# Altium schematic sheet MainBoard.SchDoc
size 381 x 241 mm
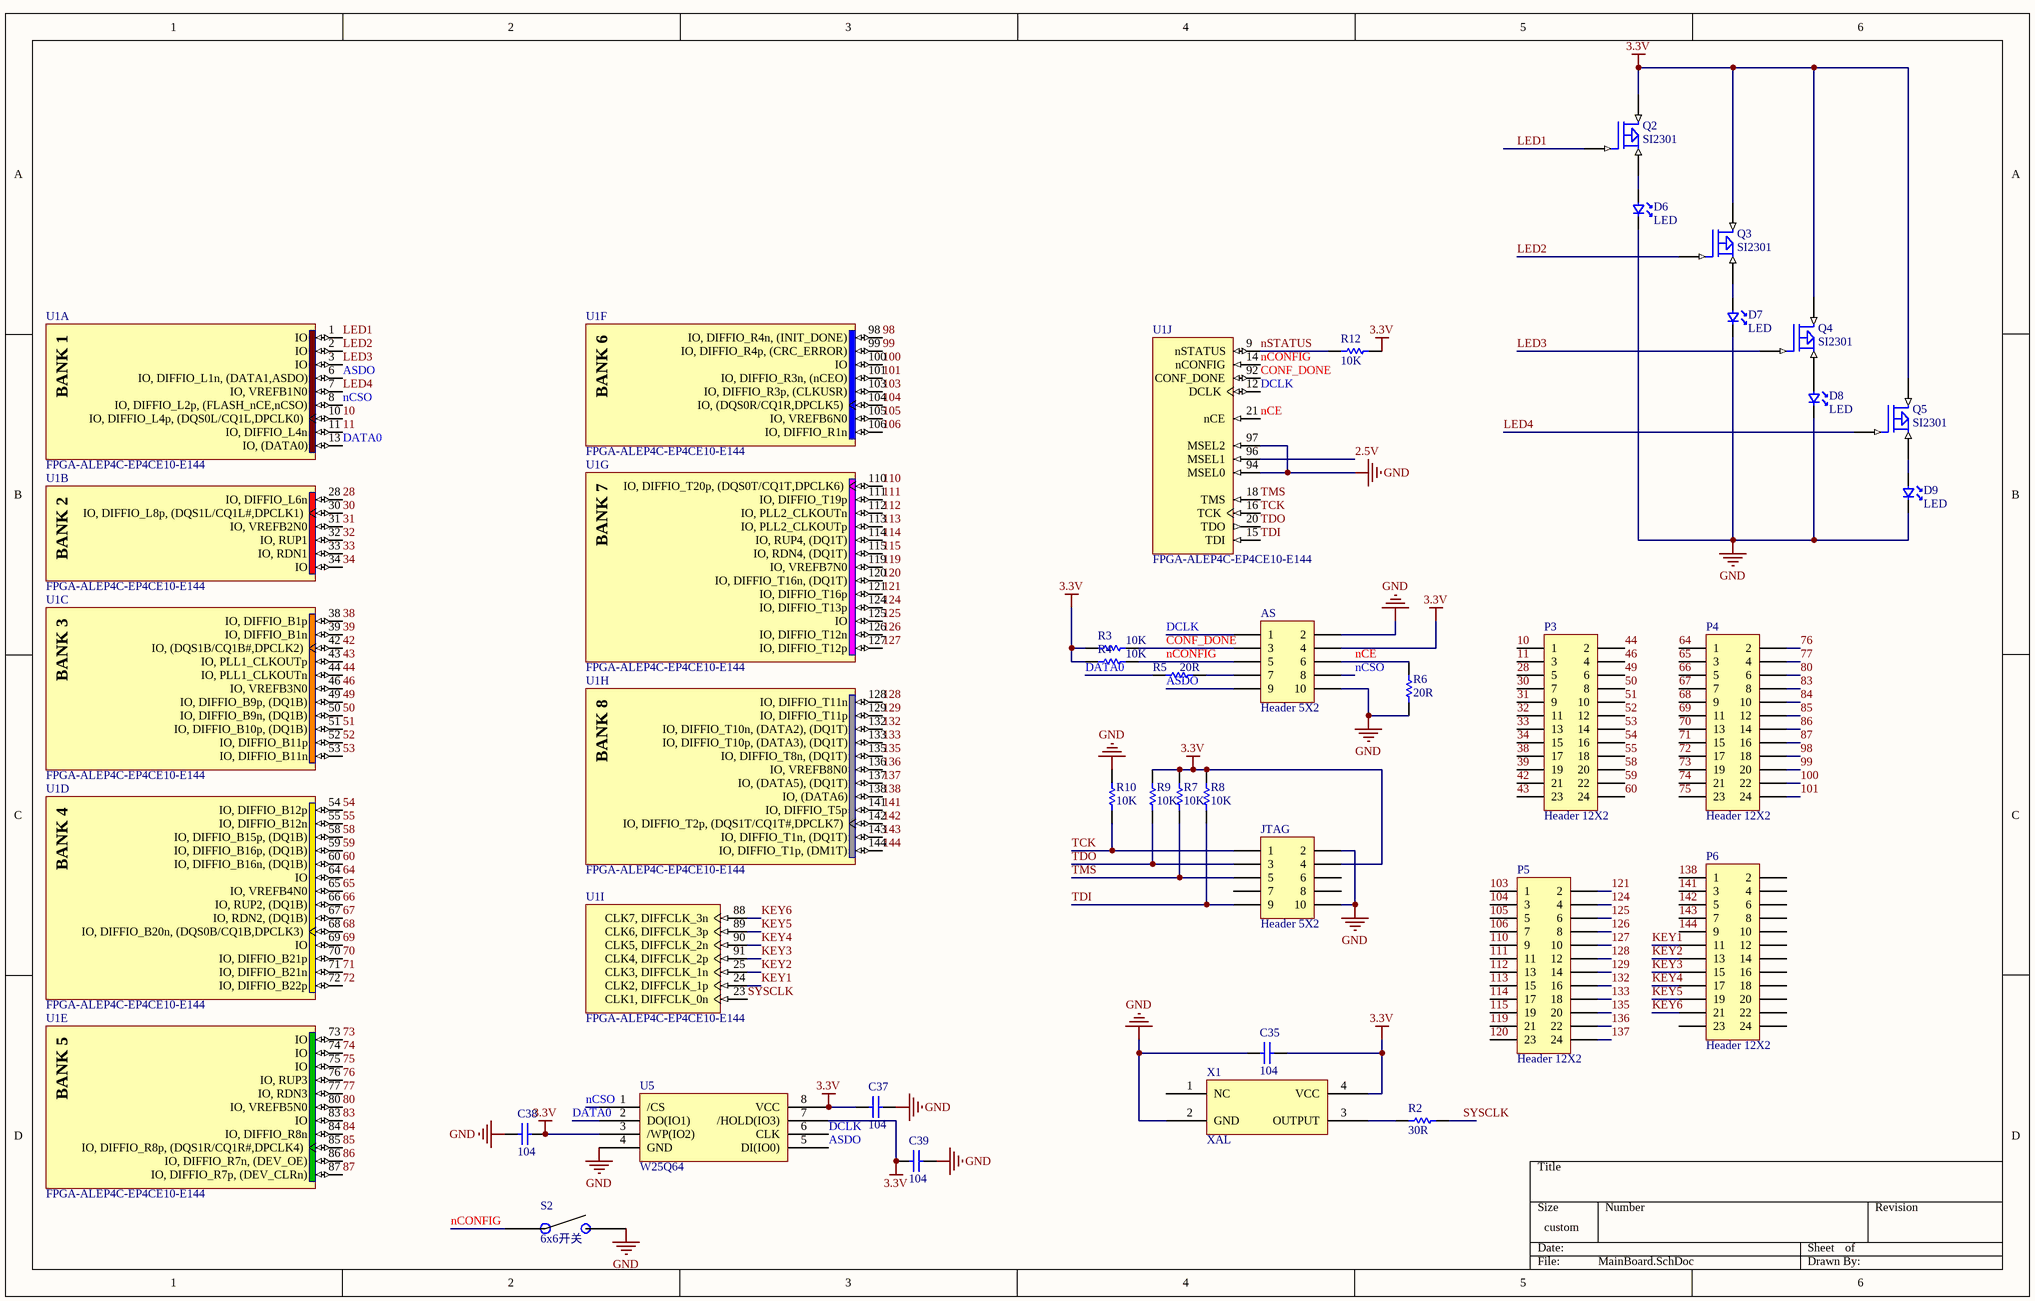
[diagram p0: MainBoard.SchDoc]

## Parts
AS  Header 5X2  [HDR2X5]
C35  104  [0805]
C37  104  [0805]
C38  104  [0805]
C39  104  [0805]
D6  LED  [0805_s]
D7  LED  [0805_s]
D8  LED  [0805_s]
D9  LED  [0805_s]
JTAG  Header 5X2  [HDR2X5]
P3  Header 12X2  [HDR2X12]
P4  Header 12X2  [HDR2X12]
P5  Header 12X2  [HDR2X12]
P6  Header 12X2  [HDR2X12]
Q2  SI2301  [SOT-23]
Q3  SI2301  [SOT-23]
Q4  SI2301  [SOT-23]
Q5  SI2301  [SOT-23]
R2  30R  [0805]
R3  10K  [0805]
R4  10K  [0805]
R5  20R  [0805]
R6  20R  [0805]
R7  10K  [0805]
R8  10K  [0805]
R9  10K  [0805]
R10  10K  [0805]
R12  10K  [0805]
S2  6x6开关  [AN66]
U1  FPGA-ALEP4C-EP4CE10-E144  [EQFP144_A-165_D2-54_L]  (parts A,B,C,D,E,F,G,H,I,J of 13)
U5  W25Q64  [LC-SOIC-8_150mil]
X1  XAL  [XAL-SMD-3225_4P]

## Nets
3.3V: AS.4 C35.2 C37.1 C38.2 C39.1 JTAG.4 Q2.2(S) Q3.2(S) Q4.2(S) Q5.2(S) R3.1 R4.1 R7.2 R8.2 R9.2 R12.2 U5.3(/WP(IO2)) U5.7(/HOLD(IO3)) U5.8(VCC) X1.4(VCC)
GND: AS.2 AS.10 C35.1 C37.2 C38.1 C39.2 D6.1 D7.1 D8.1 D9.1 JTAG.2 JTAG.10 R6.1 R10.2 S2.1 U1.94(MSEL0) U1.97(MSEL2) U5.4(GND) X1.2(GND)
2.5V: U1.96(MSEL1)
10: P3.1 U1.10(IO,_DIFFIO_L4p,_(DQS0L/CQ1L,DPCLK0))
11: P3.3 U1.11(IO,_DIFFIO_L4n)
28: P3.5 U1.28(IO,_DIFFIO_L6n)
30: P3.7 U1.30(IO,_DIFFIO_L8p,_(DQS1L/CQ1L#,DPCLK1))
31: P3.9 U1.31(IO,_VREFB2N0)
32: P3.11 U1.32(IO,_RUP1)
33: P3.13 U1.33(IO,_RDN1)
34: P3.15 U1.34(IO)
38: P3.17 U1.38(IO,_DIFFIO_B1p)
39: P3.19 U1.39(IO,_DIFFIO_B1n)
42: P3.21 U1.42(IO,_(DQS1B/CQ1B#,DPCLK2))
43: P3.23 U1.43(IO,_PLL1_CLKOUTp)
44: P3.2 U1.44(IO,_PLL1_CLKOUTn)
46: P3.4 U1.46(IO,_VREFB3N0)
49: P3.6 U1.49(IO,_DIFFIO_B9p,_(DQ1B))
50: P3.8 U1.50(IO,_DIFFIO_B9n,_(DQ1B))
51: P3.10 U1.51(IO,_DIFFIO_B10p,_(DQ1B))
52: P3.12 U1.52(IO,_DIFFIO_B11p)
53: P3.14 U1.53(IO,_DIFFIO_B11n)
54: P3.16 U1.54(IO,_DIFFIO_B12p)
55: P3.18 U1.55(IO,_DIFFIO_B12n)
58: P3.20 U1.58(IO,_DIFFIO_B15p,_(DQ1B))
59: P3.22 U1.59(IO,_DIFFIO_B16p,_(DQ1B))
60: P3.24 U1.60(IO,_DIFFIO_B16n,_(DQ1B))
64: P4.1 U1.64(IO)
65: P4.3 U1.65(IO,_VREFB4N0)
66: P4.5 U1.66(IO,_RUP2,_(DQ1B))
67: P4.7 U1.67(IO,_RDN2,_(DQ1B))
68: P4.9 U1.68(IO,_DIFFIO_B20n,_(DQS0B/CQ1B,DPCLK3))
69: P4.11 U1.69(IO)
70: P4.13 U1.70(IO,_DIFFIO_B21p)
71: P4.15 U1.71(IO,_DIFFIO_B21n)
72: P4.17 U1.72(IO,_DIFFIO_B22p)
73: P4.19 U1.73(IO)
74: P4.21 U1.74(IO)
75: P4.23 U1.75(IO)
76: P4.2 U1.76(IO,_RUP3)
77: P4.4 U1.77(IO,_RDN3)
80: P4.6 U1.80(IO,_VREFB5N0)
83: P4.8 U1.83(IO)
84: P4.10 U1.84(IO,_DIFFIO_R8n)
85: P4.12 U1.85(IO,_DIFFIO_R8p,_(DQS1R/CQ1R#,DPCLK4))
86: P4.14 U1.86(IO,_DIFFIO_R7n,_(DEV_OE))
87: P4.16 U1.87(IO,_DIFFIO_R7p,_(DEV_CLRn))
98: P4.18 U1.98(IO,_DIFFIO_R4n,_(INIT_DONE))
99: P4.20 U1.99(IO,_DIFFIO_R4p,_(CRC_ERROR))
100: P4.22 U1.100(IO)
101: P4.24 U1.101(IO,_DIFFIO_R3n,_(nCEO))
103: P5.1 U1.103(IO,_DIFFIO_R3p,_(CLKUSR))
104: P5.3 U1.104(IO,_(DQS0R/CQ1R,DPCLK5))
105: P5.5 U1.105(IO,_VREFB6N0)
106: P5.7 U1.106(IO,_DIFFIO_R1n)
110: P5.9 U1.110(IO,_DIFFIO_T20p,_(DQS0T/CQ1T,DPCLK6))
111: P5.11 U1.111(IO,_DIFFIO_T19p)
112: P5.13 U1.112(IO,_PLL2_CLKOUTn)
113: P5.15 U1.113(IO,_PLL2_CLKOUTp)
114: P5.17 U1.114(IO,_RUP4,_(DQ1T))
115: P5.19 U1.115(IO,_RDN4,_(DQ1T))
119: P5.21 U1.119(IO,_VREFB7N0)
120: P5.23 U1.120(IO,_DIFFIO_T16n,_(DQ1T))
121: P5.2 U1.121(IO,_DIFFIO_T16p)
124: P5.4 U1.124(IO,_DIFFIO_T13p)
125: P5.6 U1.125(IO)
126: P5.8 U1.126(IO,_DIFFIO_T12n)
127: P5.10 U1.127(IO,_DIFFIO_T12p)
128: P5.12 U1.128(IO,_DIFFIO_T11n)
129: P5.14 U1.129(IO,_DIFFIO_T11p)
132: P5.16 U1.132(IO,_DIFFIO_T10n,_(DATA2),_(DQ1T))
133: P5.18 U1.133(IO,_DIFFIO_T10p,_(DATA3),_(DQ1T))
135: P5.20 U1.135(IO,_DIFFIO_T8n,_(DQ1T))
136: P5.22 U1.136(IO,_VREFB8N0)
137: P5.24 U1.137(IO,_(DATA5),_(DQ1T))
138: P6.1 U1.138(IO,_(DATA6))
141: P6.3 U1.141(IO,_DIFFIO_T5p)
142: P6.5 U1.142(IO,_DIFFIO_T2p,_(DQS1T/CQ1T#,DPCLK7))
143: P6.7 U1.143(IO,_DIFFIO_T1n,_(DQ1T))
144: P6.9 U1.144(IO,_DIFFIO_T1p,_(DM1T))
ASDO: AS.9 U1.6(IO,_DIFFIO_L1n,_(DATA1,ASDO)) U5.5(DI(IO0))
CONF_DONE: AS.3 R3.2 U1.92(CONF_DONE)
DATA0: R5.1 U1.13(IO,_(DATA0)) U5.2(DO(IO1))
DCLK: AS.1 U1.12(DCLK) U5.6(CLK)
KEY1: P6.11 U1.24(CLK2,_DIFFCLK_1p)
KEY2: P6.13 U1.25(CLK3,_DIFFCLK_1n)
KEY3: P6.15 U1.91(CLK4,_DIFFCLK_2p)
KEY4: P6.17 U1.90(CLK5,_DIFFCLK_2n)
KEY5: P6.19 U1.89(CLK6,_DIFFCLK_3p)
KEY6: P6.21 U1.88(CLK7,_DIFFCLK_3n)
LED1: Q2.1(G) U1.1(IO)
LED2: Q3.1(G) U1.2(IO)
LED3: Q4.1(G) U1.3(IO)
LED4: Q5.1(G) U1.7(IO,_VREFB1N0)
nCE: AS.6 R6.2 U1.21(nCE)
nCONFIG: AS.5 R4.2 S2.2 U1.14(nCONFIG)
nCSO: AS.8 U1.8(IO,_DIFFIO_L2p,_(FLASH_nCE,nCSO)) U5.1(/CS)
nSTATUS: R12.1 U1.9(nSTATUS)
SYSCLK: R2.2 U1.23(CLK1,_DIFFCLK_0n)
TCK: JTAG.1 R10.1 U1.16(TCK)
TDI: JTAG.9 R8.1 U1.15(TDI)
TDO: JTAG.3 R9.1 U1.20(TDO)
TMS: JTAG.5 R7.1 U1.18(TMS)
NetAS_7: AS.7 R5.2
NetD6_2: D6.2 Q2.3(D)
NetD7_2: D7.2 Q3.3(D)
NetD8_2: D8.2 Q4.3(D)
NetD9_2: D9.2 Q5.3(D)
NetR2_1: R2.1 X1.3(OUTPUT)

Not connected (* = marked no-connect by the designer): JTAG 6 7 8; P6 2 4 6 8 10 12 14 16 18 20 22 23 24; X1 1(NC)

## Notes on the sheet
- (in symbol FPGA-ALEP4C-EP4CE10-E144, part A) BANK 1
- (in symbol FPGA-ALEP4C-EP4CE10-E144, part B) BANK 2
- (in symbol FPGA-ALEP4C-EP4CE10-E144, part C) BANK 3
- (in symbol FPGA-ALEP4C-EP4CE10-E144, part D) BANK 4
- (in symbol FPGA-ALEP4C-EP4CE10-E144, part E) BANK 5
- (in symbol FPGA-ALEP4C-EP4CE10-E144, part F) BANK 6
- (in symbol FPGA-ALEP4C-EP4CE10-E144, part G) BANK 7
- (in symbol FPGA-ALEP4C-EP4CE10-E144, part H) BANK 8

## Library data of the parts
AS JTAG = Header 5X2: Header, 5-Pin, Dual row; LatestRevisionDate: 17-Jul-2002; LatestRevisionNote: Re-released for DXP Platform.; Publisher: Altium Limited
C35 C37-C39 = Cap
P3-P6 = Header 12X2: Header, 12-Pin, Dual row; LatestRevisionDate: 17-Jul-2002; LatestRevisionNote: Re-released for DXP Platform.; Publisher: Altium Limited
R2-R10 R12 = Res